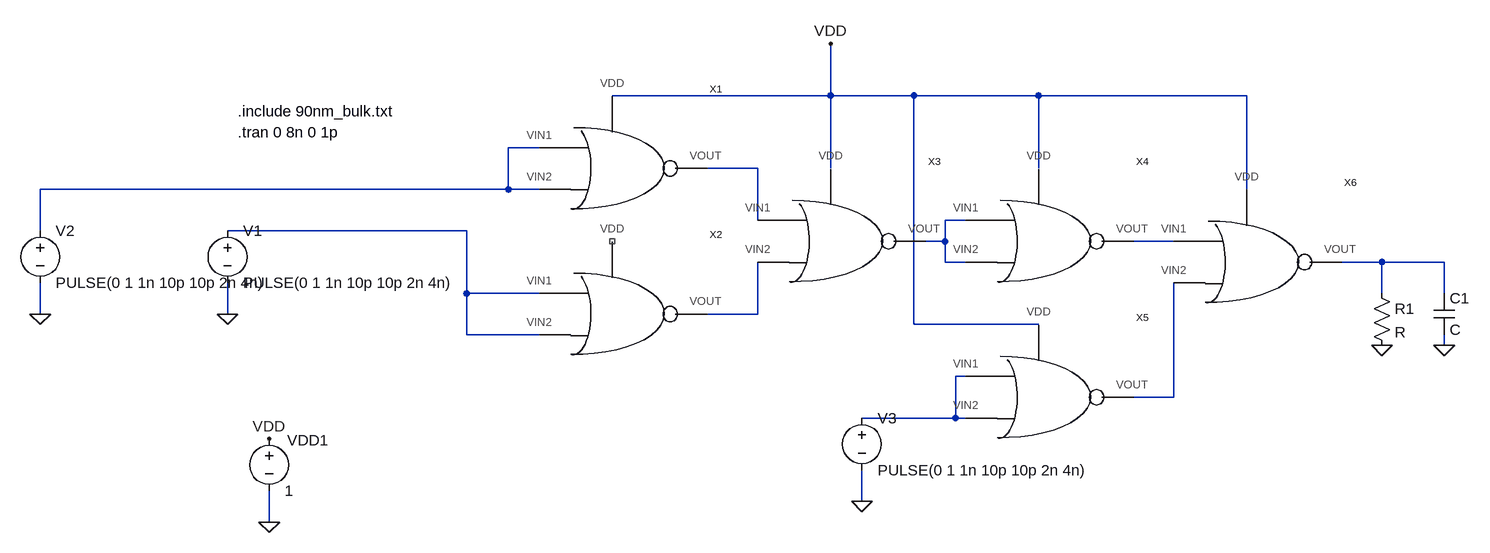
[diagram p0: schematic testFunc.asc]
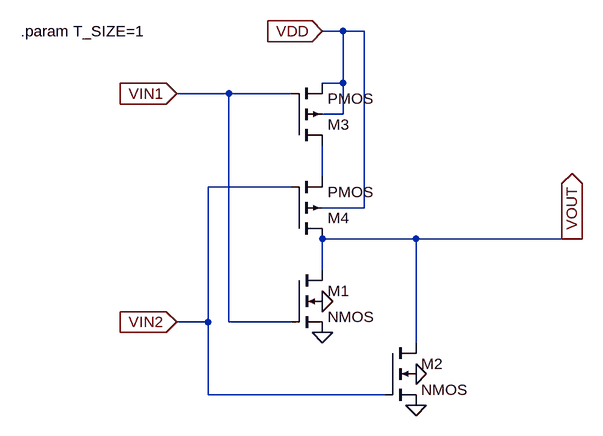
[diagram p1: sub-circuit nor.asc]
testFunc.asc, the LTspice schematic file:
Version 4
SHEET 1 1996 980
WIRE 1008 -96 1008 -176
WIRE 1008 -96 672 -96
WIRE 1136 -96 1008 -96
WIRE 1328 -96 1136 -96
WIRE 1648 -96 1328 -96
WIRE 560 -16 512 -16
WIRE 896 16 816 16
WIRE 1008 16 1008 -96
WIRE 1328 16 1328 -96
WIRE 512 48 512 -16
WIRE 512 48 -208 48
WIRE 560 48 512 48
WIRE 1648 48 1648 -96
WIRE 896 96 896 16
WIRE 1216 96 1184 96
WIRE -208 112 -208 48
WIRE 448 112 80 112
WIRE 1184 128 1184 96
WIRE 1184 128 1152 128
WIRE 1536 128 1472 128
WIRE 1184 160 1184 128
WIRE 1216 160 1184 160
WIRE 1856 160 1792 160
WIRE 1952 160 1856 160
WIRE 448 208 448 112
WIRE 560 208 448 208
WIRE 1856 208 1856 160
WIRE 1952 208 1952 160
WIRE -208 240 -208 192
WIRE 80 240 80 192
WIRE 896 240 896 160
WIRE 896 240 816 240
WIRE 1136 256 1136 -96
WIRE 1328 256 1136 256
WIRE 448 272 448 208
WIRE 560 272 448 272
WIRE 1952 288 1952 272
WIRE 1216 336 1200 336
WIRE 1536 368 1536 192
WIRE 1536 368 1472 368
WIRE 1200 400 1200 336
WIRE 1200 400 1056 400
WIRE 1216 400 1200 400
WIRE 1056 528 1056 480
WIRE 144 560 144 512
FLAG 144 432 VDD
FLAG 144 560 0
FLAG 80 240 0
FLAG -208 240 0
FLAG 1056 528 0
FLAG 1008 -176 VDD
FLAG 1856 288 0
FLAG 1952 288 0
SYMBOL voltage 80 96 R0
SYMATTR InstName V1
SYMATTR Value PULSE(0 1 1n 10p 10p 2n 4n)
SYMBOL voltage 144 416 R0
WINDOW 0 28 18 Left 2
SYMATTR InstName VDD1
SYMATTR Value 1
SYMBOL voltage -208 96 R0
WINDOW 123 0 0 Left 2
WINDOW 39 0 0 Left 2
SYMATTR InstName V2
SYMATTR Value PULSE(0 1 1n 10p 10p 2n 4n)
SYMBOL NOR 608 16 R0
SYMATTR InstName X1
SYMBOL NOR 608 240 R0
SYMATTR InstName X2
SYMBOL NOR 944 128 R0
SYMATTR InstName X3
SYMBOL NOR 1264 128 R0
SYMATTR InstName X4
SYMBOL NOR 1264 368 R0
SYMATTR InstName X5
SYMBOL NOR 1584 160 R0
SYMATTR InstName X6
SYMBOL voltage 1056 384 R0
WINDOW 123 0 0 Left 2
WINDOW 39 0 0 Left 2
SYMATTR InstName V3
SYMATTR Value PULSE(0 1 1n 10p 10p 2n 4n)
SYMBOL res 1840 192 R0
SYMATTR InstName R1
SYMBOL cap 1936 208 R0
SYMATTR InstName C1
TEXT 96 -40 Left 2 !.tran 0 8n 0 1p
TEXT 96 -72 Left 2 !.include 90nm_bulk.txt

nor.asc, the sub-circuit schematic file:
Version 4
SHEET 1 880 680
WIRE 320 -144 288 -144
WIRE 352 -144 320 -144
WIRE 320 -64 320 -144
WIRE 320 -64 288 -64
WIRE 144 -48 64 -48
WIRE 240 -48 144 -48
WIRE 320 -16 320 -64
WIRE 320 -16 288 -16
WIRE 288 80 288 32
WIRE 240 96 112 96
WIRE 352 128 352 -144
WIRE 352 128 288 128
WIRE 432 176 288 176
WIRE 672 176 432 176
WIRE 688 176 672 176
WIRE 288 224 288 176
WIRE 112 304 112 96
WIRE 112 304 64 304
WIRE 144 304 144 -48
WIRE 240 304 144 304
WIRE 432 336 432 176
WIRE 112 416 112 304
WIRE 384 416 112 416
FLAG 64 -48 VIN1
IOPIN 64 -48 In
FLAG 64 304 VIN2
IOPIN 64 304 In
FLAG 288 -144 VDD
IOPIN 288 -144 In
FLAG 672 176 VOUT
IOPIN 672 176 Out
FLAG 432 384 0
FLAG 288 320 0
FLAG 288 272 0
FLAG 432 432 0
SYMBOL nmos4 240 224 R0
SYMATTR InstName M1
SYMATTR Value2 l=90n w='T_SIZE*200n'
SYMBOL nmos4 384 336 R0
SYMATTR InstName M2
SYMATTR Value2 l=90n w='T_SIZE*200n'
SYMBOL pmos4 240 32 M180
SYMATTR InstName M3
SYMATTR Value2 l=90n w='T_SIZE*400n'
SYMBOL pmos4 240 176 M180
SYMATTR InstName M4
SYMATTR Value2 l=90n w='T_SIZE*400n'
TEXT -176 -144 Left 2 !.param T_SIZE=1

The netlist it stands for:
* testFunc.asc
V1 N004 0 PULSE(0 1 1n 10p 10p 2n 4n)
VDD1 VDD 0 1
V2 N001 0 PULSE(0 1 1n 10p 10p 2n 4n)
XX1 N001 N001 VDD N002 nor
XX2 N004 N004 NC_01 N007 nor
XX3 N002 N007 VDD N003 nor
XX4 N003 N003 VDD N005 nor
XX5 N008 N008 VDD N009 nor
XX6 N005 N009 VDD N006 nor
V3 N008 0 PULSE(0 1 1n 10p 10p 2n 4n)
R1 N006 0 R
C1 N006 0 C

* block symbol definitions
.subckt nor VIN1 VIN2 VDD VOUT
M1 VOUT VIN1 0 0 NMOS l=90n w='T_SIZE*200n'
M2 VOUT VIN2 0 0 NMOS l=90n w='T_SIZE*200n'
M3 N001 VIN1 VDD VDD PMOS l=90n w='T_SIZE*400n'
M4 VOUT VIN2 N001 VDD PMOS l=90n w='T_SIZE*400n'
.param T_SIZE=1
.ends nor

.model NMOS NMOS
.model PMOS PMOS
.lib standard.mos
.tran 0 8n 0 1p
.include 90nm_bulk.txt
.backanno
.end